# Altium project 2_order_filter.PrjPcb
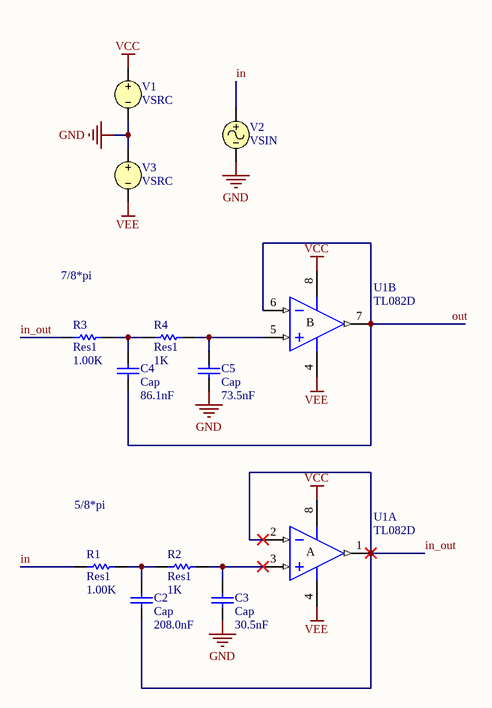
[diagram p0: Sheet1.SchDoc]
1 sheet, 12 parts. Net scope: global (net labels, ports and power ports of the same name join across sheets).

## Sheet Sheet1.SchDoc
size A4

### Parts
C2  Cap  value 208.0nF  [RAD-0.3]
C3  Cap  value 30.5nF  [RAD-0.3]
C4  Cap  value 86.1nF  [RAD-0.3]
C5  Cap  value 73.5nF  [RAD-0.3]
R1  Res1  value 1.00K  [AXIAL-0.3]
R2  Res1  value 1K  [AXIAL-0.3]
R3  Res1  value 1.00K  [AXIAL-0.3]
R4  Res1  value 1K  [AXIAL-0.3]
U1  TL082D  [D008_L]  (parts A,B of 2)
V1  VSRC
V2  VSIN
V3  VSRC

### Nets
GND: C3.1 C5.1 V1.2 V2.2 V3.1
VCC: U1.8(V+) V1.1
VEE: U1.4(V-) V3.2
in: R1.1 V2.1
in_out: C2.1 R3.1 U1.1(OUT) U1.2(IN-)
out: C4.1 U1.6(IN-) U1.7(OUT)
NetC2_2: C2.2 R1.2 R2.1
NetC3_2: C3.2 R2.2 U1.3(IN+)
NetC4_2: C4.2 R3.2 R4.1
NetC5_2: C5.2 R4.2 U1.5(IN+)

### Notes on the sheet
- 7/8*pi
- 5/8*pi
- (in symbol TL082D, part A) A
- (in symbol TL082D, part B) B

### Library data of the parts
C2-C5 = Cap: Capacitor; Published: 8-Jun-2000; LatestRevisionDate: 17-Jul-2002; LatestRevisionNote: Re-released for DXP Platform.; PackageReference: RAD-0.3; Publisher: Altium Limited; PackageDescription: Radial Cap, Thru-Hole; 2 Leads; 0.3 in Pin Spacing
R1-R4 = Res1: Resistor; Published: 8-Jun-2000; LatestRevisionDate: 17-Jul-2002; LatestRevisionNote: Re-released for DXP Platform.; PackageReference: AXIAL-0.3; Publisher: Altium Limited; PackageDescription: Axial Device, Thru-Hole; 2 Leads; 0.3 in Pin Spacing
U1 = TL082D: JFET-Input Operational Amplifier; Published: 16-Jan-2001; LatestRevisionDate: 13-Apr-2006; LatestRevisionNote: IPC-7351 Footprint Added.; DatasheetVersion: Feb-1999; PackageVersion: Jan-1998; PackageReference: D008; Publisher: Altium Limited; PackageDescription: 8-Pin Small Outline Integrated Circuit 1.27 mm Pitch; Code_IPC: SOIC127P600-8; ComponentLink1Description: Manufacturer Link; ComponentLink1URL: http://www.ti.com/; ComponentLink2Description: Datasheet; ComponentLink2URL: http://www-s.ti.com/sc/ds/tl082.pdf
V1 = VSRC: Voltage Source; Note: PCB Footprint - Not required; Value: 15; Published: 8-Jun-2000; LatestRevisionDate: 17-Jul-2002; LatestRevisionNote: Re-released for DXP Platform.; PackageReference: Not Applicable; Publisher: Altium Limited
V2 = VSIN: Sinusoidal Voltage Source; Note: PCB Footprint - Not required; Published: 8-Jun-2000; LatestRevisionDate: 15-Nov-2004; LatestRevisionNote: Corrected Netlist.; PackageReference: Not Applicable; Publisher: Altium Limited
V3 = VSRC: Voltage Source; Note: PCB Footprint - Not required; Value: 15V; Published: 8-Jun-2000; LatestRevisionDate: 17-Jul-2002; LatestRevisionNote: Re-released for DXP Platform.; PackageReference: Not Applicable; Publisher: Altium Limited